# Altium schematic sheet QUTMS-TSAL-S03.SchDoc: Green LED Array
size A3; DrawnBy: Joseph Richards; DocumentNumber: 4; Revision: 1; SheetNumber: 4; SheetTotal: 5
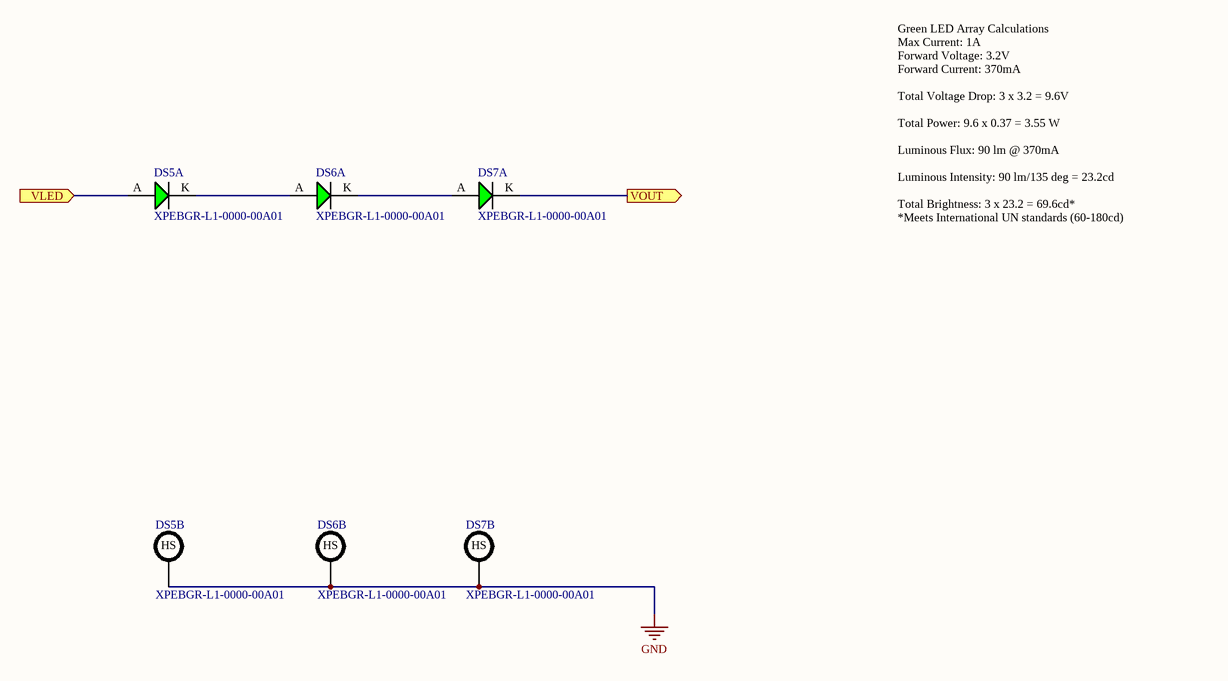
[diagram p0: QUTMS-TSAL-S03.SchDoc]

## Parts
DS5  XPEBGR-L1-0000-00A01  [Cree XLamp XP-E2]  (parts A,B of 2)
DS6  XPEBGR-L1-0000-00A01  [Cree XLamp XP-E2]  (parts A,B of 2)
DS7  XPEBGR-L1-0000-00A01  [Cree XLamp XP-E2]  (parts A,B of 2)

## Ports
VLED (in), VOUT (out)

## Nets
GND: DS5.HS DS6.HS DS7.HS
VLED: DS5.A ; port VLED
VOUT: DS7.K ; port VOUT
NetDS5_K: DS5.K DS6.A
NetDS6_K: DS6.K DS7.A

## Notes on the sheet
- Green LED Array Calculations
  Max Current: 1A
  Forward Voltage: 3.2V
  Forward Current: 370mA
  Total Voltage Drop: 3 x 3.2 = 9.6V
  Total Power: 9.6 x 0.37 = 3.55 W
  Luminous Flux: 90 lm @ 370mA
  Luminous Intensity: 90 lm/135 deg = 23.2cd
  Total Brightness: 3 x 23.2 = 69.6cd*
  *Meets International UN standards (60-180cd)
- Revision History:
- Sheet Title:
- Rev
- Date
- Description
- Project:
- Size:
- Drawn By:
- A3
- Number:
- Revision:
- Sheet
- Version:
- of
- QUT Motorsport
- O-120, Gardens Point
- 2 George Street
- Brisbane, QLD 4000
- Australia
- Print Date:
- Print Time:
- File Name:

## Library data of the parts
DS5-DS7 = XPEBGR-L1-0000-00A01: LED, Cree XLamp XP-E2 Series, Green, 535 nm, 135 °, 87.4 lm, 1 A; ComponentLink1Description: Element14; ComponentLink1URL: https://au.element14.com/cree/xpebrd-l1-0000-00601/led-smd-xlamp-xpe-e-red-62lm/dp/2335107